# Altium schematic sheet mcu.SchDoc: {Наименование}
size 420 x 297 mm; ApprovedBy: {Утвердил}; CheckedBy: {Проверил}; DrawnBy: {Разработал}; Engineer: {Инженер}; DocumentNumber: {Обозначение}; SheetNumber: {}; SheetTotal: {}; Scale: {Масш.}; Title1str: {Наименование}; PageSetup: Record=PageOptions|CenterHorizontal=False|CenterVertical=False|PrintScale=0.95|XCorrection=0.00|YCorrection=0.00|PrintKind=1|BorderSize=5000000|LeftOffset=0|BottomOffset=0|Orientation=1|PaperLength=1000|PaperWidth=1000|Scale=100|PaperSource=15|PrintQuality=600|MediaType=1|DitherType=10|PaperKind=A4|PrintScaleMode=1; Title2str: {Наименование}; ProcessInspection: {Т.контр.}; Mass: {Масса}; NormInspection: {Н.контр.}; EngineerName: {Инженер}; Letter1Column: {}; Letter2Column: {}; Letter3Column: {}; DocumentType: {Документ}; DocumentType1str: {Документ}; DocumentType2str: {Документ}; ImagePath: {Перв. применение}; Rule: PcbType=ProtelPcb
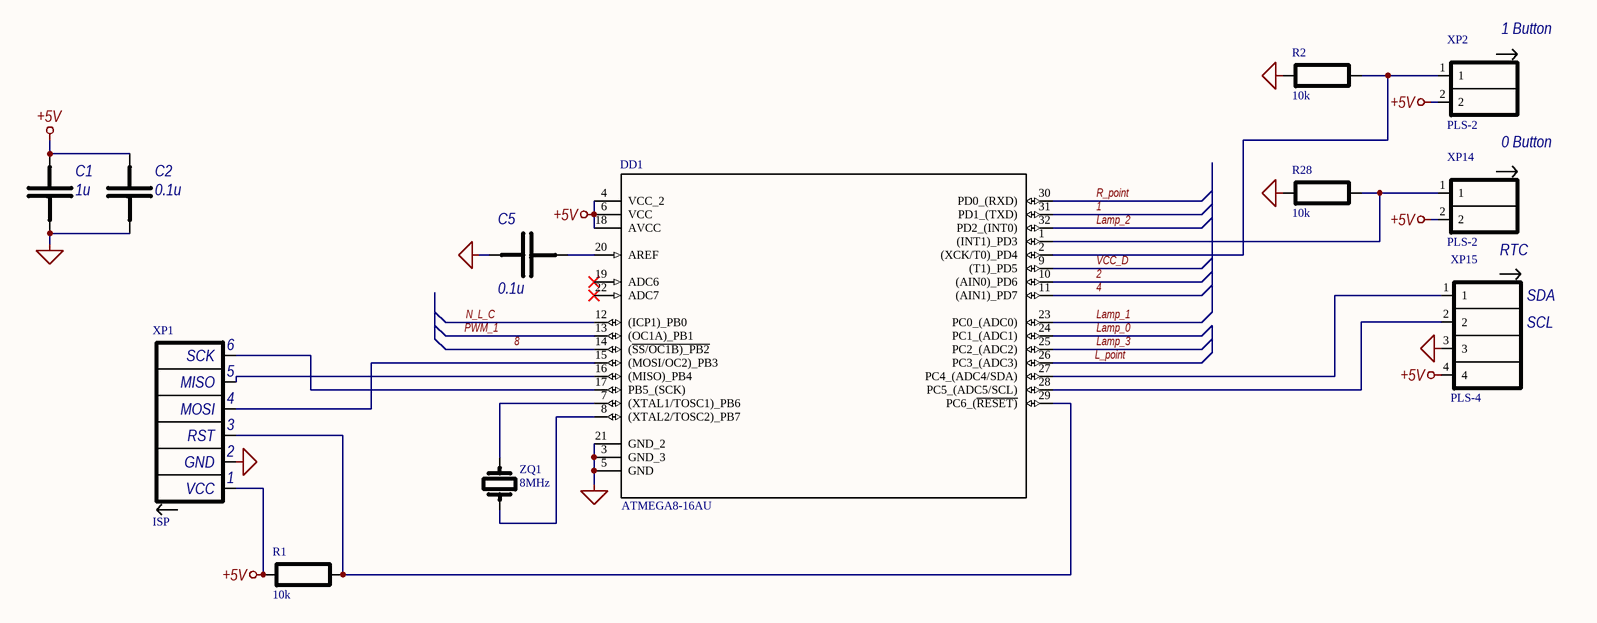
[diagram p0: mcu.SchDoc]

## Parts
C1  1u  [CR2012-0805]
C2  0.1u  [CR2012-0805]
C5  0.1u  [CR2012-0805]
DD1  ATMEGA8-16AU  [*QFP80P900X900X120-32N]
R1  10k  [CR2012-0805]
R2  10k  [CR2012-0805]
R28  10k  [CR2012-0805]
XP1  ISP  [PLS-6]
XP2  PLS-2  [PLS-2]
XP14  PLS-2  [PLS-2]
XP15  PLS-4  [PLS-4]
ZQ1  8MHz  [CRYSTAL]

## Nets
+5V: C1.1 C2.1 DD1.4(VCC_2) DD1.6(VCC) DD1.18(AVCC) R1.1 XP1.1(VCC) XP2.2 XP14.2 XP15.4
SGND: C1.2 C2.2 C5.1 DD1.3(GND_3) DD1.5(GND) DD1.21(GND_2) R2.1 R28.1 XP1.2(GND) XP15.3
1: DD1.31(PD1_(TXD))
2: DD1.10((AIN0)_PD6)
4: DD1.11((AIN1)_PD7)
8: DD1.14((~{SS/OC1B)_PB2})
L_point: DD1.26(PC3_(ADC3))
Lamp_0: DD1.24(PC1_(ADC1))
Lamp_1: DD1.23(PC0_(ADC0))
Lamp_2: DD1.32(PD2_(INT0))
Lamp_3: DD1.25(PC2_(ADC2))
N_L_C: DD1.12((ICP1)_PB0)
PWM_1: DD1.13((OC1A)_PB1)
R_point: DD1.30(PD0_(RXD))
VCC_D: DD1.9((T1)_PD5)
NetC5_2: C5.2 DD1.20(AREF)
NetDD1_1: DD1.1((INT1)_PD3) R28.2 XP14.1
NetDD1_2: DD1.2((XCK/T0)_PD4) R2.2 XP2.1
NetDD1_7: DD1.7((XTAL1/TOSC1)_PB6) ZQ1.1
NetDD1_8: DD1.8((XTAL2/TOSC2)_PB7) ZQ1.2
NetDD1_15: DD1.15((MOSI/OC2)_PB3) XP1.4(MOSI)
NetDD1_16: DD1.16((MISO)_PB4) XP1.5(MISO)
NetDD1_17: DD1.17(PB5_(SCK)) XP1.6(SCK)
NetDD1_27: DD1.27(PC4_(ADC4/SDA)) XP15.1
NetDD1_28: DD1.28(PC5_(ADC5/SCL)) XP15.2
NetDD1_29: DD1.29(PC6_(~{RESET)}) R1.2 XP1.3(RST)

Not connected (* = marked no-connect by the designer): DD1 19(ADC6)* 22(ADC7)*

## Notes on the sheet
- 1 Button
- 0 Button
- RTC
- SDA
- SCL
- Перв. примен.
- Справ. №
- Подп. и дата
- Инв. № дубл.
- Взам. инв. №
- Изм.
- Лист
- № докум.
- Подп.
- Дата
- Лит.
- Масса
- Масштаб
- Т.контр.
- Пров.
- Разраб.
- Листов
- Инв. № подл.
- Н.контр.
- Утв.
- Копировал
- Формат А3

## Library data of the parts
C1 = C0805-1u-X7R
C2 C5 = C0805-0.1u-X7R
DD1 = ATMEGA8-16AU: / AVR AVRВ® ATmega Microcontroller IC 8-Bit 16MHz 8KB _4K x 16_ FLASH 32-TQFP _7x7_ /; MF: Microchip Technology; SnapEDA_Link: https://www.snapeda.com/parts/ATMEGA8-16AU/Microchip/view-part/4246640/?ref=snap; Price: None; MP: ATMEGA8-16AU; Availability: Unavailable; Package: TQFP-32 Microchip Technology; Value: *
R1 R2 R28 = R0805-10k-5%
ZQ1 = Crystal_8MHz